# EAGLE schematic External Diagram FSAE 2024 (EAGLE 9.6.2)
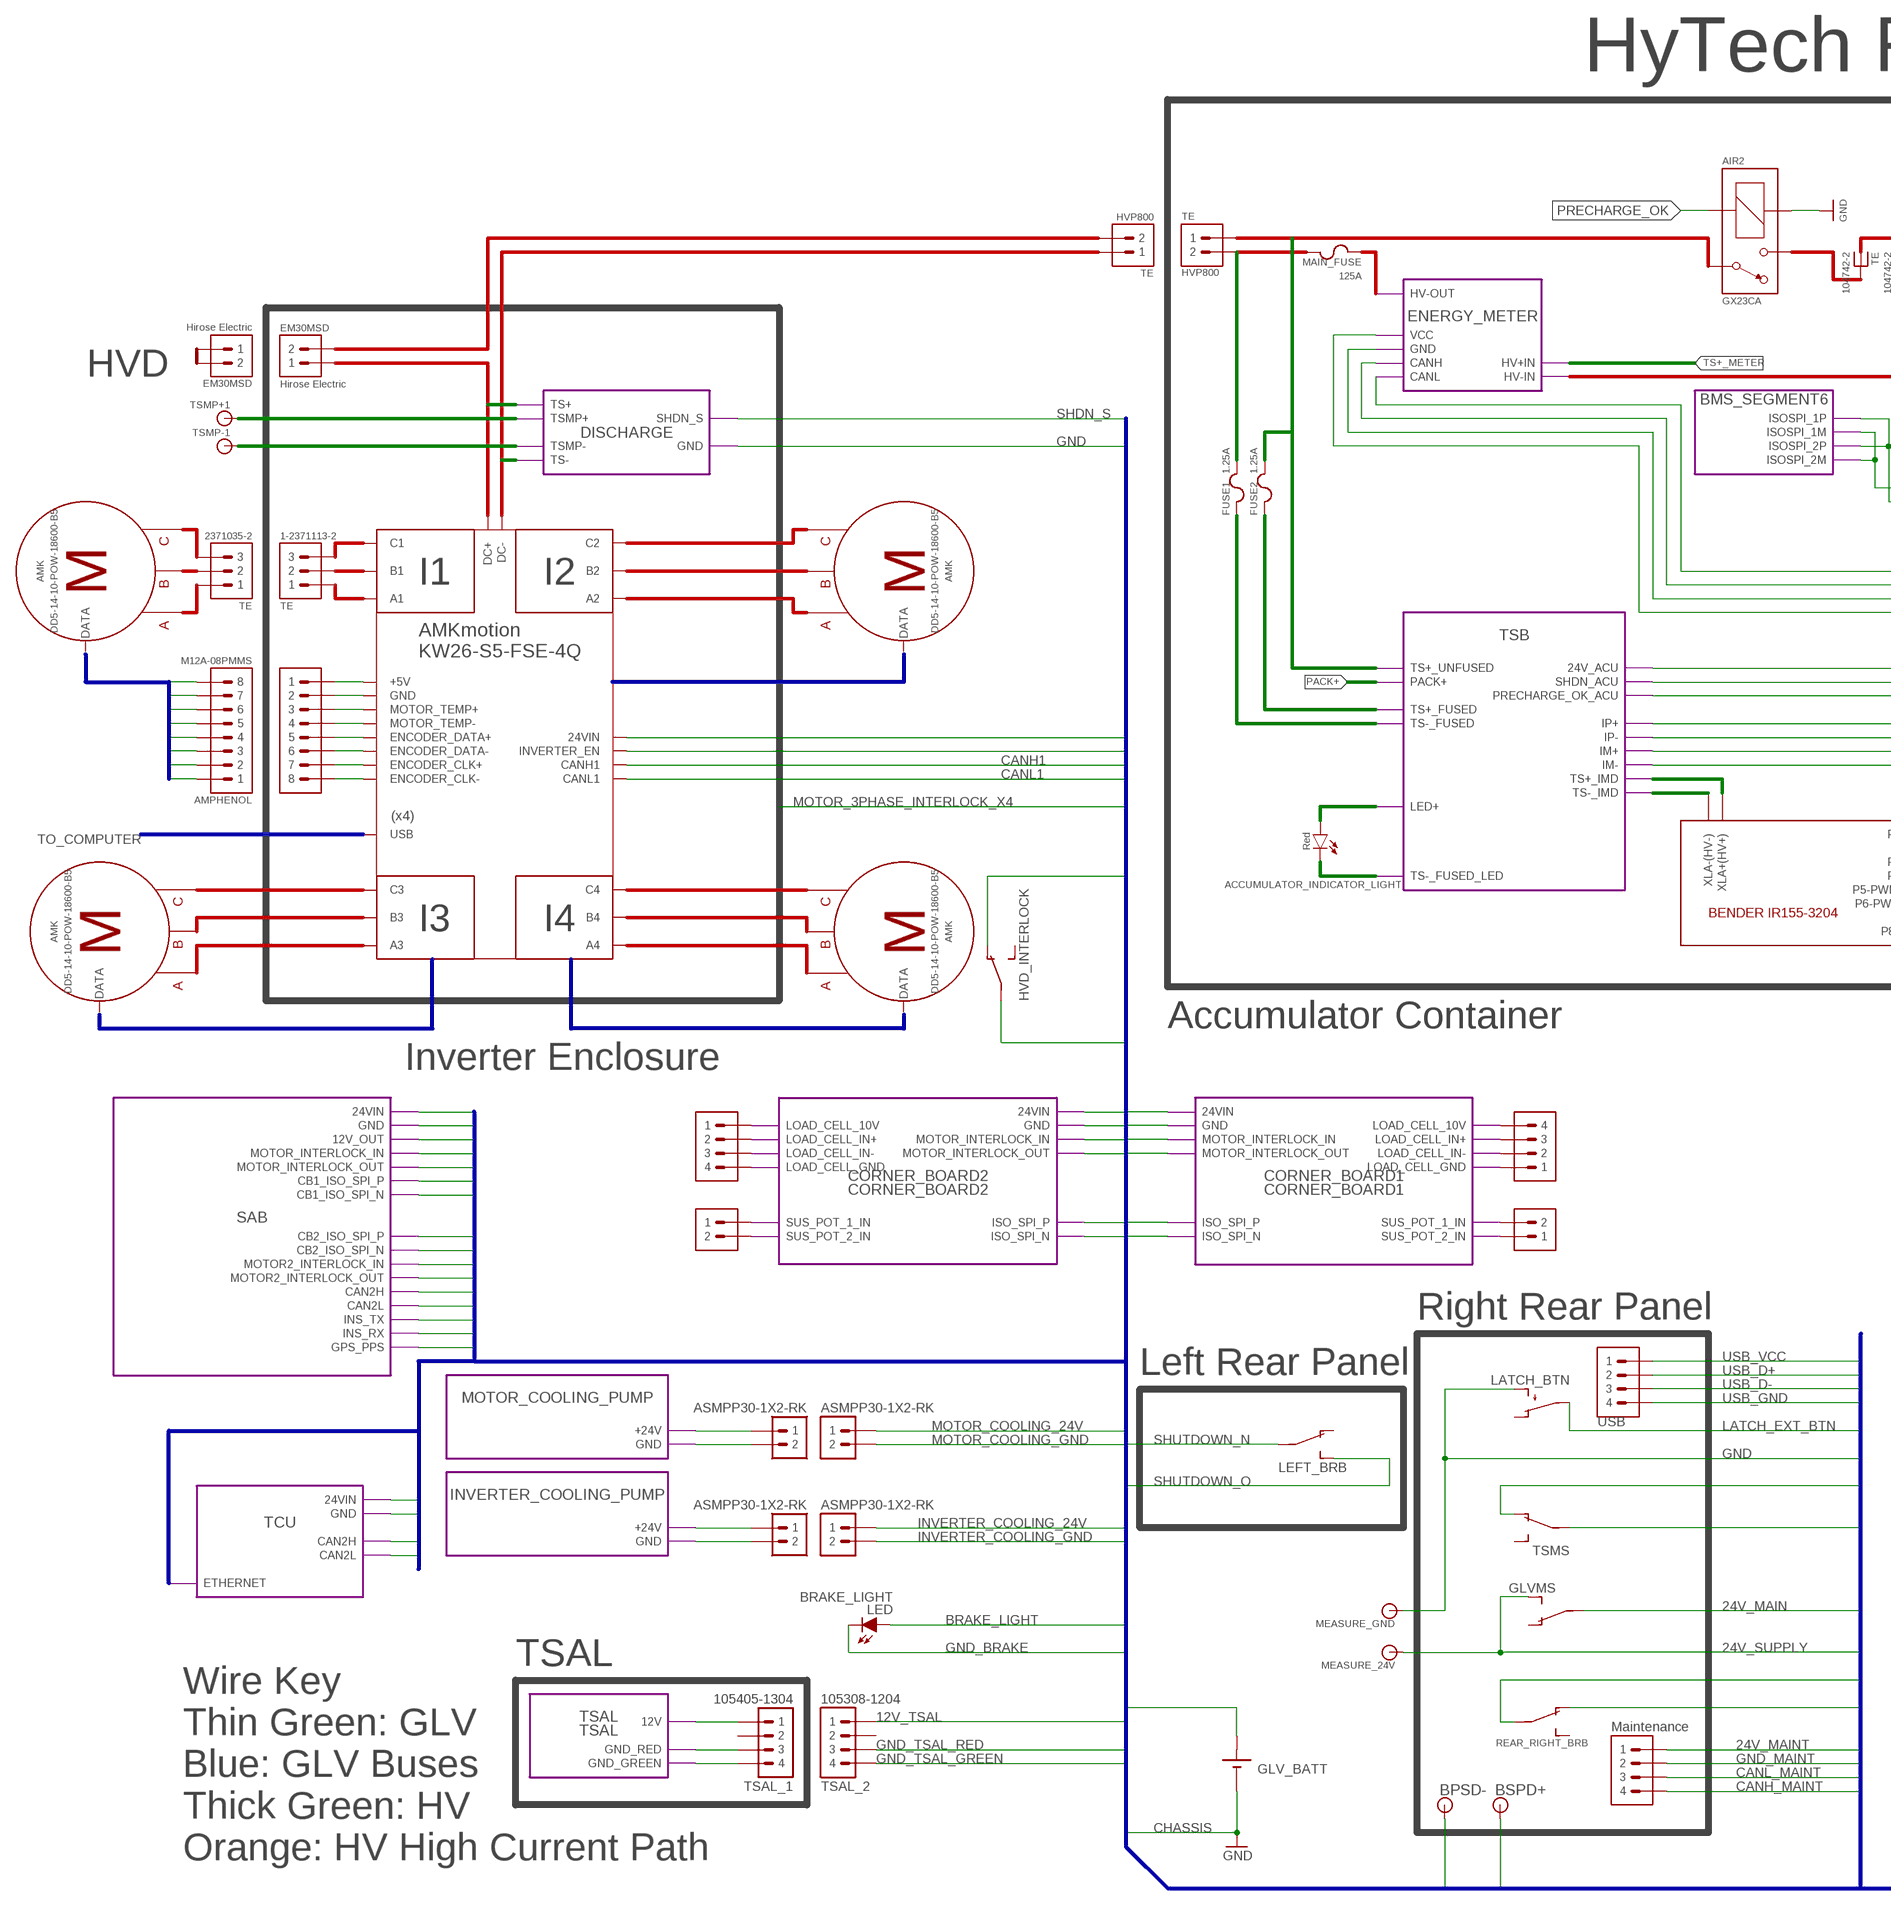
[diagram p0: schematic, sheet 1, part 1 of 2]
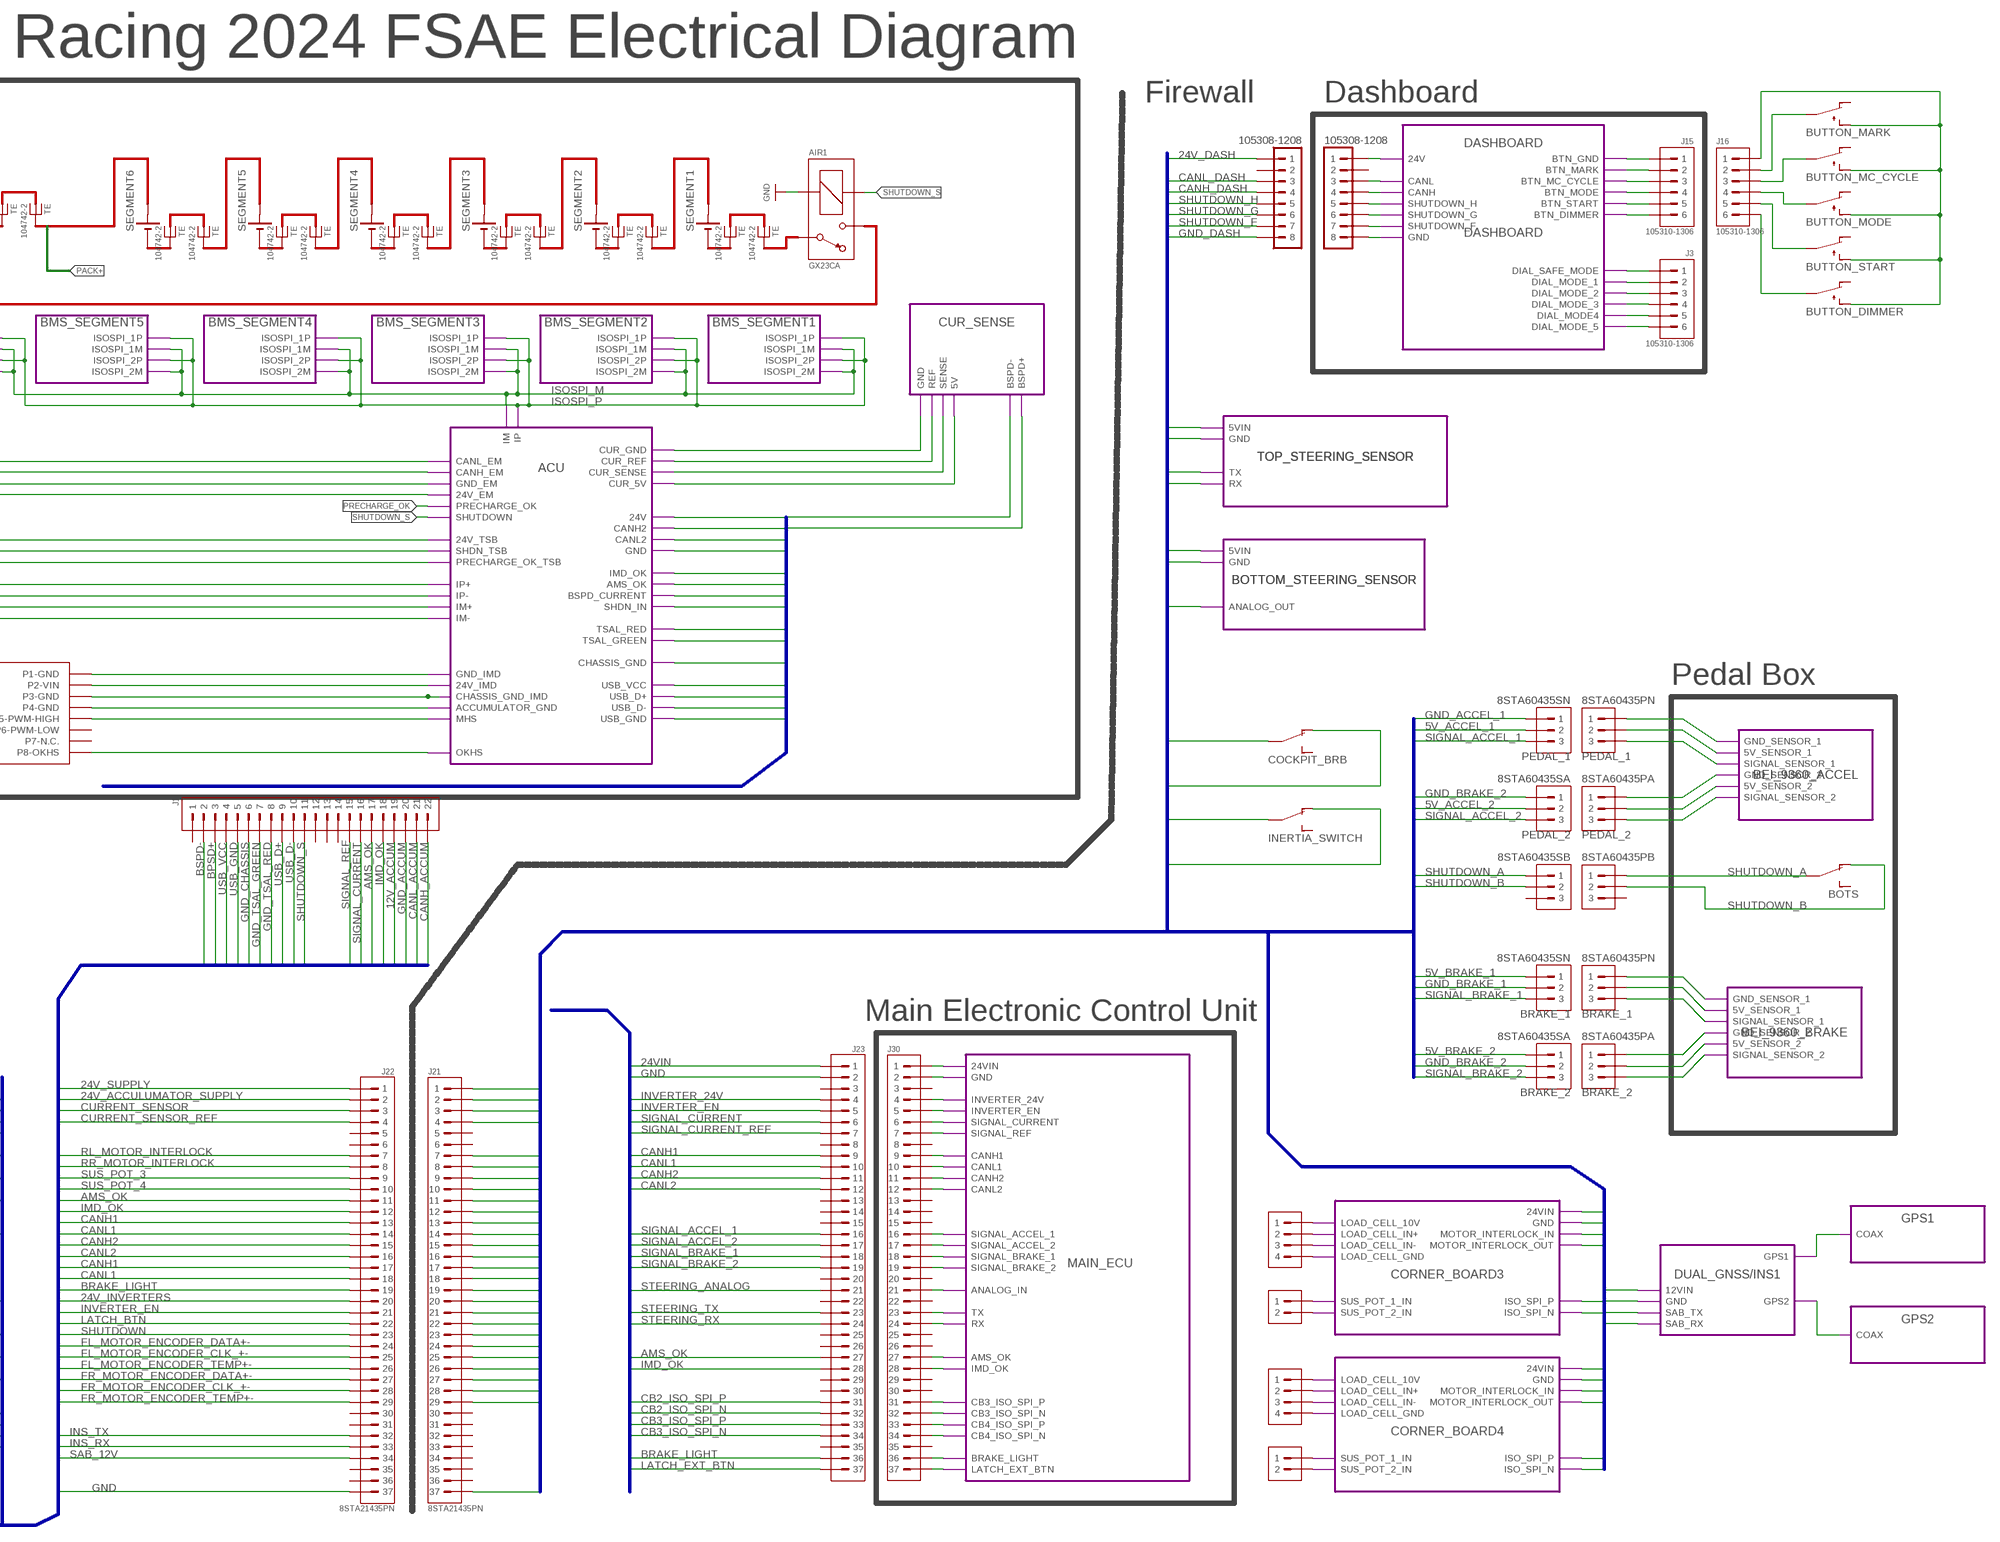
[diagram p1: schematic, sheet 1, part 2 of 2]

## Parts
ACCUMULATOR_INDICATOR_LIGHT  LED_0603_RED  [0603-LED]
AIR1  RELAY_SPST_NO_GX23BA  (no package)
AIR2  RELAY_SPST_NO_GX23BA  (no package)
BOTS  SWITCH_SPST  (no package)
BPSD-  BANANA_JACK  (no package)
BRAKE_LIGHT  LED  (no package)
BSPD+  BANANA_JACK  (no package)
BUTTON_DIMMER  SWITCH_SPST_MOM  (no package)
BUTTON_MARK  SWITCH_SPST_MOM  (no package)
BUTTON_MC_CYCLE  SWITCH_SPST_MOM  (no package)
BUTTON_MODE  SWITCH_SPST_MOM  (no package)
BUTTON_START  SWITCH_SPST_MOM  (no package)
COCKPIT_BRB  SWITCH_SPST  (no package)
DASH_IN_3  105308-1208  M08  (no package)
DASH_IN_4  105308-1208  M08  (no package)
FUSE1  1.25A  FUSE  (no package)
FUSE2  1.25A  FUSE  (no package)
GLV_BATT  BATTERY_1_CELL  (no package)
GLVMS  SWITCH_SPST  (no package)
HVD_INTERLOCK  SWITCH_SPST  (no package)
INERTIA_SWITCH  SWITCH_SPST  (no package)
J1  CONNECTOR-22_SOURIAU_  [SOURIAU_12-35]
J2  CONNECTOR-4_  (no package)
J3  CONNECTOR-6_NF_T_V_BLACK  [MOLEX_NANOFIT_PTH_06]
J4  CONNECTOR-4_  (no package)
J5  CONNECTOR-3_  (no package)
J6  CONNECTOR-3_  (no package)
J7  CONNECTOR-3_  (no package)
J8  CONNECTOR-3_  (no package)
J9  CONNECTOR-3_  (no package)
J10  CONNECTOR-3_  (no package)
J11  CONNECTOR-3_  (no package)
J12  CONNECTOR-3_  (no package)
J13  CONNECTOR-3_  (no package)
J14  CONNECTOR-3_  (no package)
J15  CONNECTOR-6_NF_T_V_BLACK  [MOLEX_NANOFIT_PTH_06]
J16  CONNECTOR-6_NF_T_V_BLACK  [MOLEX_NANOFIT_PTH_06]
J17  CONNECTOR-2_0436500214  (no package)
J18  CONNECTOR-4_  (no package)
J19  CONNECTOR-2_0436500214  (no package)
J20  CONNECTOR-4_  (no package)
J21  CONNECTOR-37__  [SOURIAU_14-35]
J22  CONNECTOR-37__  [SOURIAU_14-35]
J23  CONNECTOR-37__  [SOURIAU_14-35]
J24  CONNECTOR-8_  (no package)
J25  CONNECTOR-8_  (no package)
J28  CONNECTOR-2_HIROSE  (no package)
J29  CONNECTOR-2_HIROSE  (no package)
J30  CONNECTOR-37__  [SOURIAU_14-35]
J31  CONNECTOR-4_  (no package)
J32  CONNECTOR-2_0436500214  (no package)
J33  CONNECTOR-4_  (no package)
J34  CONNECTOR-2_0436500214  (no package)
J35  CONNECTOR-3_2371035-2  (no package)
J36  CONNECTOR-3_1-2371113-2  (no package)
LATCH_BTN  SWITCH_SPST_MOM  (no package)
MAIN_FUSE  125A  FUSE  (no package)
MEASURE_24V  BANANA_JACK  (no package)
MEASURE_GND  BANANA_JACK  (no package)
PUMP_1  ASMPP30-1X2-RK  M02  (no package)
PUMP_2  ASMPP30-1X2-RK  M02  (no package)
PUMP_3  ASMPP30-1X2-RK  M02  (no package)
PUMP_4  ASMPP30-1X2-RK  M02  (no package)
S2  SWITCH_SPST_40MM_STOP  (no package)
S3  SWITCH_SPST_40MM_STOP  (no package)
SEGMENT1  BATTERY_1_CELL  (no package)
SEGMENT2  BATTERY_1_CELL  (no package)
SEGMENT3  BATTERY_1_CELL  (no package)
SEGMENT4  BATTERY_1_CELL  (no package)
SEGMENT5  BATTERY_1_CELL  (no package)
SEGMENT6  BATTERY_1_CELL  (no package)
TSAL_1  105405-1304  M04  (no package)
TSAL_2  105308-1204  M04  (no package)
TSMP+1  BANANA_JACK  (no package)
TSMP-1  BANANA_JACK  (no package)
TSMS  SWITCH_SPST  (no package)
U$1  MAINTENANCE_PLUG_104742-2  (no package)
U$2  BENDER_IR155-3204  (no package)
U$3  MAINTENANCE_PLUG_104742-2  (no package)
U$4  MAINTENANCE_PLUG_104742-2  (no package)
U$5  MAINTENANCE_PLUG_104742-2  (no package)
U$6  MAINTENANCE_PLUG_104742-2  (no package)
U$7  MAINTENANCE_PLUG_104742-2  (no package)
U$8  MAINTENANCE_PLUG_104742-2  (no package)
U$9  MAINTENANCE_PLUG_104742-2  (no package)
U$10  MAINTENANCE_PLUG_104742-2  (no package)
U$11  MAINTENANCE_PLUG_104742-2  (no package)
U$12  AMKBIG  (no package)
U$13  MOTOR_AC_SMALL_AMK  (no package)
U$14  MOTOR_AC_SMALL_AMK  (no package)
U$15  MAINTENANCE_PLUG_104742-2  (no package)
U$16  MOTOR_AC_SMALL_AMK  (no package)
U$17  MOTOR_AC_SMALL_AMK  (no package)
U$18  MAINTENANCE_PLUG_104742-2  (no package)
U$19  MAINTENANCE_PLUG_104742-2  (no package)
U$20  MAINTENANCE_PLUG_104742-2  (no package)
U$21  CONNECTOR-2_HVP800  (no package)
U$22  CONNECTOR-2_HVP800  (no package)

## Module instances
BMS_SEGMENT2 = BMS_SEGMENT
BMS_SEGMENT3 = BMS_SEGMENT
BMS_SEGMENT4 = BMS_SEGMENT
MOTOR_COOLING_PUMP = COOLING_MODULE
MAIN_ECU = MAIN_ECU
BEI_9360_ACCEL = BEI_9360
ENERGY_METER = ENERGY_METER
ACU = ACU
DASHBOARD = DASHBOARD
BMS_SEGMENT1 = BMS_SEGMENT
TSB = TSB
TSAL = TSAL
CUR_SENSE = CUR_SENSE
DISCHARGE = DISCHARGE (part numbers offset by 200)
BMS_SEGMENT5 = BMS_SEGMENT
BMS_SEGMENT6 = BMS_SEGMENT
INVERTER_COOLING_PUMP = COOLING_MODULE
BEI_9360_BRAKE = BEI_9360
TOP_STEERING_SENSOR = TOP_STEERING_SENSOR
BOTTOM_STEERING_SENSOR = BOTTOM_STEERING_SENSOR
CORNER_BOARD1 = CORNER_BOARD
CORNER_BOARD2 = CORNER_BOARD
CORNER_BOARD4 = CORNER_BOARD
CORNER_BOARD3 = CORNER_BOARD
SAB = SAB
TCU = TCU
DUAL_GNSS/INS1 = DUAL_GNSS/INS
GPS1 = GPS
GPS2 = GPS

## Nets
5V_ACCEL_1: J11.2
5V_ACCEL_2: J12.2
5V_BRAKE_1: J7.1
5V_BRAKE_2: J8.1
12V_ACCUM: J1.19
12V_TSAL: TSAL_2.1
12VSUPPLY_COOLING_PUMP_1: PUMP_2.1 ; port MOTOR_COOLING_PUMP.+24V
12VSUPPLY_COOLING_PUMP_2: PUMP_3.1 ; port INVERTER_COOLING_PUMP.+24V
24V_ACCULUMATOR_SUPPLY: J22.2
24V_DASH: DASH_IN_4.1
24V_INVERTERS: J22.20
24V_MAIN: GLVMS.P
24V_MAINT: J20.1
24V_SUPPLY: GLVMS.S J22.1 MEASURE_24V.1
24VIN: J23.1
+5V_MOTOR: J25.8
AMS_OK: J1.17 J22.11 J23.27
B$1: port ACU.24V ACU.CANH2 ACU.GND ACU.CANL2 ACU.IMD_OK ACU.AMS_OK ACU.BSPD_CURRENT ACU.SHDN_IN ACU.TSAL_RED ACU.TSAL_GREEN ACU.CHASSIS_GND ACU.USB_VCC ACU.USB_D+ ACU.USB_D- SAB.GPS_PPS SAB.INS_RX SAB.INS_TX SAB.MOTOR2_INTERLOCK_OUT SAB.MOTOR2_INTERLOCK_IN SAB.CB2_ISO_SPI_N SAB.CB2_ISO_SPI_P SAB.CB1_ISO_SPI_N SAB.CB1_ISO_SPI_P SAB.MOTOR_INTERLOCK_OUT SAB.MOTOR_INTERLOCK_IN SAB.GND SAB.24VIN TCU.24VIN TCU.GND TCU.CAN2H TCU.CAN2L SAB.CAN2H SAB.CAN2L SAB.12V_OUT
BAT+: GLV_BATT.+
BPSD+: BSPD+.1 J1.3
BRAKE_LIGHT: BRAKE_LIGHT.A J22.19 J23.36
BSPD-: BPSD-.1 J1.2
CANH1: J22.13 J22.17 J23.9 U$12.24VIN
CANH2: J22.15 J23.11 U$12.CANH1
CANH_ACCUM: J1.22
CANH_DASH: DASH_IN_4.4
CANH_MAINT: J20.4
CANL1: J22.14 J22.18 J23.10 U$12.INVERTER_EN
CANL2: J22.16 J23.12 U$12.CANL1
CANL_ACCUM: J1.21
CANL_DASH: DASH_IN_4.3
CANL_MAINT: J20.3
CB2_ISO_SPI_N: J23.32
CB2_ISO_SPI_P: J23.31
CB3_ISO_SPI_N: J23.34
CB3_ISO_SPI_P: J23.33
CURRENT_SENSOR: J22.3
CURRENT_SENSOR_REF: J22.4
ENCODER_CLK+: J25.2
ENCODER_CLK-: J25.1
ENCODER_DATA+: J25.4
ENCODER_DATA-: J25.3
FL_MOTOR_ENCODER_CLK_+-: J22.25
FL_MOTOR_ENCODER_DATA+-: J22.24
FL_MOTOR_ENCODER_TEMP+-: J22.26
FR_MOTOR_ENCODER_CLK_+-: J22.28
FR_MOTOR_ENCODER_DATA+-: J22.27
FR_MOTOR_ENCODER_TEMP+-: J22.29
GND: AIR1.COIL+ AIR2.COIL- GLV_BATT.- J22.37 J23.2 J25.7 LATCH_BTN.S MEASURE_GND.1 ; port DISCHARGE.GND
GND_ACCEL_1: J11.1
GND_ACCUM: J1.20
GND_BRAKE: BRAKE_LIGHT.C
GND_BRAKE_1: J7.2
GND_BRAKE_2: J8.2 J12.1
GND_CHASSIS: J1.6
GND_DASH: DASH_IN_4.8
GND_MAINT: J20.2
GND_RADIATOR: PUMP_2.2 PUMP_3.2 ; port MOTOR_COOLING_PUMP.GND INVERTER_COOLING_PUMP.GND
GND_TSAL_GREEN: J1.7 TSAL_2.4
GND_TSAL_RED: J1.8 TSAL_2.3
IMD_OK: J1.18 J22.12 J23.28
INS_RX: J22.33
INS_TX: J22.32
INVERTER_24V: J23.4
INVERTER_COOLING_24V: PUMP_4.1
INVERTER_COOLING_GND: PUMP_4.2
INVERTER_EN: J22.21 J23.5
ISOSPI_M: port BMS_SEGMENT2.ISOSPI_1M BMS_SEGMENT2.ISOSPI_2M BMS_SEGMENT4.ISOSPI_2M BMS_SEGMENT4.ISOSPI_1M BMS_SEGMENT3.ISOSPI_2M BMS_SEGMENT3.ISOSPI_1M ACU.IM BMS_SEGMENT5.ISOSPI_1M BMS_SEGMENT5.ISOSPI_2M BMS_SEGMENT6.ISOSPI_1M BMS_SEGMENT6.ISOSPI_2M
ISOSPI_P: port BMS_SEGMENT2.ISOSPI_1P BMS_SEGMENT2.ISOSPI_2P BMS_SEGMENT4.ISOSPI_1P BMS_SEGMENT3.ISOSPI_1P BMS_SEGMENT3.ISOSPI_2P ACU.IP BMS_SEGMENT5.ISOSPI_1P BMS_SEGMENT5.ISOSPI_2P BMS_SEGMENT4.ISOSPI_2P BMS_SEGMENT6.ISOSPI_1P BMS_SEGMENT6.ISOSPI_2P
LATCH_BTN: J22.22
LATCH_EXT_BTN: J23.37 LATCH_BTN.P
MOTOR_COOLING_24V: PUMP_1.1
MOTOR_COOLING_GND: PUMP_1.2
MOTOR_TEMP+: J25.6
MOTOR_TEMP-: J25.5
N$1: BUTTON_START.P J16.5
N$2: ACCUMULATOR_INDICATOR_LIGHT.2(A) ; port TSB.LED+
N$3: TSAL_1.1 ; port TSAL.12V
N$5: port CUR_SENSE.BSPD+
N$6: port ACU.USB_GND
N$7: J24.1 U$12.+5V
N$8: port TSB.IM+ ACU.IM+
N$9: port TSB.IP- ACU.IP-
N$10: port TSB.IP+ ACU.IP+
N$11: port TSB.24V_ACU ACU.24V_TSB
N$12: J5.1 ; port BEI_9360_BRAKE.GND_SENSOR_1
N$13: J5.2 ; port BEI_9360_BRAKE.5V_SENSOR_1
N$14: J5.3 ; port BEI_9360_BRAKE.SIGNAL_SENSOR_1
N$15: DASH_IN_3.1 ; port DASHBOARD.24V
N$16: J6.1 ; port BEI_9360_BRAKE.GND_SENSOR_2
N$17: J24.2 U$12.GND
N$18: DASH_IN_3.3 ; port DASHBOARD.CANL
N$19: DASH_IN_3.4 ; port DASHBOARD.CANH
N$20: J10.1 ; port BEI_9360_ACCEL.GND_SENSOR_2
N$21: DASH_IN_3.5 ; port DASHBOARD.SHUTDOWN_H
N$22: DASH_IN_3.6 ; port DASHBOARD.SHUTDOWN_G
N$23: DASH_IN_3.7 ; port DASHBOARD.SHUTDOWN_F
N$24: J24.3 U$12.MOTOR_TEMP+
N$25: J10.2 ; port BEI_9360_ACCEL.5V_SENSOR_2
N$26: port TSB.IM- ACU.IM-
N$27: J15.1 ; port DASHBOARD.BTN_GND
N$28: J15.2 ; port DASHBOARD.BTN_MARK
N$29: J15.3 ; port DASHBOARD.BTN_MC_CYCLE
N$30: J15.4 ; port DASHBOARD.BTN_MODE
N$31: J15.5 ; port DASHBOARD.BTN_START
N$32: J15.6 ; port DASHBOARD.BTN_DIMMER
N$33: J24.4 U$12.MOTOR_TEMP-
N$34: J24.5 U$12.ENCODER_DATA+
N$35: port TSB.SHDN_ACU ACU.SHDN_TSB
N$36: J9.1 ; port BEI_9360_ACCEL.GND_SENSOR_1
N$37: J6.2 ; port BEI_9360_BRAKE.5V_SENSOR_2
N$38: port TSB.PRECHARGE_OK_ACU ACU.PRECHARGE_OK_TSB
N$39: J10.3 ; port BEI_9360_ACCEL.SIGNAL_SENSOR_2
N$40: port CUR_SENSE.BSPD-
N$41: BUTTON_MODE.P J16.4
N$42: U$2.P1-GND ; port ACU.GND_IMD
N$43: BUTTON_MC_CYCLE.P J16.3
N$44: U$2.P2-VIN ; port ACU.24V_IMD
N$45: U$2.P3-GND ; port ACU.CHASSIS_GND_IMD
N$46: U$2.P4-GND ; port ACU.ACCUMULATOR_GND
N$47: BUTTON_DIMMER.S BUTTON_MARK.S BUTTON_MC_CYCLE.S BUTTON_MODE.S BUTTON_START.S J16.1
N$48: BUTTON_MARK.P J16.2
N$49: BUTTON_DIMMER.P J16.6
N$50: J6.3 ; port BEI_9360_BRAKE.SIGNAL_SENSOR_2
N$51: J9.2 ; port BEI_9360_ACCEL.5V_SENSOR_1
N$52: J9.3 ; port BEI_9360_ACCEL.SIGNAL_SENSOR_1
N$53: DASH_IN_3.8 ; port DASHBOARD.GND
N$54: J3.1 ; port DASHBOARD.DIAL_SAFE_MODE
N$55: J3.2 ; port DASHBOARD.DIAL_MODE_1
N$56: J3.3 ; port DASHBOARD.DIAL_MODE_2
N$57: J3.4 ; port DASHBOARD.DIAL_MODE_3
N$58: J3.5 ; port DASHBOARD.DIAL_MODE4
N$59: J3.6 ; port DASHBOARD.DIAL_MODE_5
N$60: port ENERGY_METER.VCC ACU.24V_EM
N$61: port DISCHARGE.TS+
N$62: FUSE1.2 U$21.2
N$63: FUSE2.1 ; port TSB.TS+_FUSED DUAL_GNSS/INS1.GND
N$64: J24.6 U$12.ENCODER_DATA-
N$65: J24.7 U$12.ENCODER_CLK+ ; port DUAL_GNSS/INS1.SAB_TX
N$66: J24.8 U$12.ENCODER_CLK- ; port DUAL_GNSS/INS1.SAB_RX
N$67: U$2.P5-PWM-HIGH ; port ACU.MHS
N$68: FUSE1.1 ; port TSB.TS-_FUSED
N$69: ACCUMULATOR_INDICATOR_LIGHT.1(C) ; port TSB.TS-_FUSED_LED
N$70: port TOP_STEERING_SENSOR.5VIN
N$71: port TOP_STEERING_SENSOR.GND
N$72: U$2.XLA+(HV+) ; port TSB.TS+_IMD
N$73: port DUAL_GNSS/INS1.GPS2 GPS2.COAX
N$74: port TOP_STEERING_SENSOR.TX
N$75: port ACU.CUR_5V CUR_SENSE.5V
N$76: U$2.XLA-(HV-) ; port TSB.TS-_IMD
N$77: J30.1 ; port MAIN_ECU.24VIN
N$78: port ENERGY_METER.CANL ACU.CANL_EM DUAL_GNSS/INS1.12VIN
N$79: TSMP+1.1 ; port DISCHARGE.TSMP+
N$80: port TOP_STEERING_SENSOR.RX
N$81: TSAL_1.3 ; port TSAL.GND_RED
N$82: TSAL_1.4 ; port TSAL.GND_GREEN
N$83: port DUAL_GNSS/INS1.GPS1 GPS1.COAX
N$84: port BOTTOM_STEERING_SENSOR.5VIN
N$85: port BOTTOM_STEERING_SENSOR.GND
N$86: port BOTTOM_STEERING_SENSOR.ANALOG_OUT
N$87: J4.1 ; port CORNER_BOARD1.LOAD_CELL_GND
N$88: J4.2 ; port CORNER_BOARD1.LOAD_CELL_IN-
N$89: J4.3 ; port CORNER_BOARD1.LOAD_CELL_IN+
N$90: J4.4 ; port CORNER_BOARD1.LOAD_CELL_10V
N$91: J17.1 ; port CORNER_BOARD1.SUS_POT_2_IN
N$92: J17.2 ; port CORNER_BOARD1.SUS_POT_1_IN
N$93: J19.1 ; port CORNER_BOARD2.SUS_POT_1_IN
N$94: TSMP-1.1 ; port DISCHARGE.TSMP-
N$95: J19.2 ; port CORNER_BOARD2.SUS_POT_2_IN
N$96: J18.1 ; port CORNER_BOARD2.LOAD_CELL_10V
N$97: J18.2 ; port CORNER_BOARD2.LOAD_CELL_IN+
N$98: J18.3 ; port CORNER_BOARD2.LOAD_CELL_IN-
N$99: J18.4 ; port CORNER_BOARD2.LOAD_CELL_GND
N$100: port CORNER_BOARD2.24VIN
N$101: port CORNER_BOARD2.GND
N$102: U$2.P8-OKHS ; port ACU.OKHS
N$103: port CORNER_BOARD2.MOTOR_INTERLOCK_IN
N$104: port ENERGY_METER.GND ACU.GND_EM
N$105: port ENERGY_METER.CANH ACU.CANH_EM
N$106: port ACU.CUR_SENSE CUR_SENSE.SENSE
N$107: port ACU.CUR_REF CUR_SENSE.REF
N$108: port ACU.CUR_GND CUR_SENSE.GND
N$109: port CORNER_BOARD2.MOTOR_INTERLOCK_OUT
N$111: port CORNER_BOARD2.ISO_SPI_P
N$112: port CORNER_BOARD2.ISO_SPI_N
N$113: port CORNER_BOARD1.24VIN
N$114: port CORNER_BOARD1.GND
N$115: port CORNER_BOARD1.MOTOR_INTERLOCK_IN
N$116: port CORNER_BOARD1.MOTOR_INTERLOCK_OUT
N$118: port CORNER_BOARD1.ISO_SPI_P
N$119: port CORNER_BOARD1.ISO_SPI_N
N$120: J21.1
N$121: J21.2
N$122: J21.3
N$123: J21.4
N$126: J21.7
N$127: J21.8
N$128: J21.9
N$129: J21.10
N$130: J21.11
N$131: J21.37
N$132: J21.29
N$133: J21.28
N$134: J21.27
N$135: J21.26
N$136: J21.25
N$137: J21.24
N$138: J21.23
N$139: J21.22
N$140: J21.21
N$141: J21.20
N$142: J21.19
N$143: J21.18
N$144: J21.17
N$145: J21.16
N$146: J21.15
N$147: J21.14
N$148: J21.13
N$149: J21.12
N$150: J30.2 ; port MAIN_ECU.GND
N$151: J30.4 ; port MAIN_ECU.INVERTER_24V
N$152: J30.5 ; port MAIN_ECU.INVERTER_EN
N$153: J30.7 ; port MAIN_ECU.SIGNAL_REF
N$154: J30.6 ; port MAIN_ECU.SIGNAL_CURRENT
N$155: J30.9 ; port MAIN_ECU.CANH1
N$156: J30.10 ; port MAIN_ECU.CANL1
N$157: J30.11 ; port MAIN_ECU.CANH2
N$158: J30.12 ; port MAIN_ECU.CANL2
N$161: J30.16 ; port MAIN_ECU.SIGNAL_ACCEL_1
N$162: J30.17 ; port MAIN_ECU.SIGNAL_ACCEL_2
N$163: J30.18 ; port MAIN_ECU.SIGNAL_BRAKE_1
N$164: J30.19 ; port MAIN_ECU.SIGNAL_BRAKE_2
N$165: J30.21 ; port MAIN_ECU.ANALOG_IN
N$167: J30.23 ; port MAIN_ECU.TX
N$168: J30.24 ; port MAIN_ECU.RX
N$170: J30.27 ; port MAIN_ECU.AMS_OK
N$171: J30.28 ; port MAIN_ECU.IMD_OK
N$172: J30.31 ; port MAIN_ECU.CB3_ISO_SPI_P
N$173: J30.32 ; port MAIN_ECU.CB3_ISO_SPI_N
N$174: J30.33 ; port MAIN_ECU.CB4_ISO_SPI_P
N$175: J30.34 ; port MAIN_ECU.CB4_ISO_SPI_N
N$176: J30.36 ; port MAIN_ECU.BRAKE_LIGHT
N$177: J30.37 ; port MAIN_ECU.LATCH_EXT_BTN
N$178: J32.1 ; port CORNER_BOARD3.SUS_POT_1_IN
N$179: J32.2 ; port CORNER_BOARD3.SUS_POT_2_IN
N$180: J31.1 ; port CORNER_BOARD3.LOAD_CELL_10V
N$181: J31.2 ; port CORNER_BOARD3.LOAD_CELL_IN+
N$182: J31.3 ; port CORNER_BOARD3.LOAD_CELL_IN-
N$183: J31.4 ; port CORNER_BOARD3.LOAD_CELL_GND
N$184: J34.1 ; port CORNER_BOARD4.SUS_POT_1_IN
N$185: J34.2 ; port CORNER_BOARD4.SUS_POT_2_IN
N$186: J33.1 ; port CORNER_BOARD4.LOAD_CELL_10V
N$187: J33.2 ; port CORNER_BOARD4.LOAD_CELL_IN+
N$188: J33.3 ; port CORNER_BOARD4.LOAD_CELL_IN-
N$189: J33.4 ; port CORNER_BOARD4.LOAD_CELL_GND
N$190: port CORNER_BOARD4.24VIN
N$191: port CORNER_BOARD4.GND
N$192: port CORNER_BOARD4.MOTOR_INTERLOCK_IN
N$193: port CORNER_BOARD4.MOTOR_INTERLOCK_OUT
N$195: port CORNER_BOARD4.ISO_SPI_P
N$196: port CORNER_BOARD4.ISO_SPI_N
N$197: port CORNER_BOARD3.24VIN
N$198: port CORNER_BOARD3.GND
N$199: port CORNER_BOARD3.MOTOR_INTERLOCK_IN
N$200: port CORNER_BOARD3.MOTOR_INTERLOCK_OUT
N$202: port CORNER_BOARD3.ISO_SPI_P
N$203: port CORNER_BOARD3.ISO_SPI_N
N$204: port DISCHARGE.TS-
PACK+: port TSB.PACK+
PRECHARGE_OK: AIR2.COIL+ ; port ACU.PRECHARGE_OK
RL_MOTOR_INTERLOCK: J22.7
RR_MOTOR_INTERLOCK: J22.8
SAB_12V: J22.34
SHDN_S: port DISCHARGE.SHDN_S
SHUTDOWN: J22.23
SHUTDOWN_A: BOTS.P J13.1 J14.1
SHUTDOWN_B: BOTS.O J13.2 J14.2
SHUTDOWN_F: DASH_IN_4.7
SHUTDOWN_G: DASH_IN_4.6
SHUTDOWN_H: DASH_IN_4.5
SHUTDOWN_K: INERTIA_SWITCH.P
SHUTDOWN_L: COCKPIT_BRB.P INERTIA_SWITCH.O
SHUTDOWN_M: COCKPIT_BRB.O
SHUTDOWN_N: S2.P
SHUTDOWN_O: S2.S S3.P
SHUTDOWN_P: S3.O
SHUTDOWN_Q: HVD_INTERLOCK.P
SHUTDOWN_R: HVD_INTERLOCK.O TSMS.P
SHUTDOWN_S: AIR1.COIL- J1.11 TSMS.O ; port ACU.SHUTDOWN
SIGNAL_ACCEL_1: J11.3 J23.16
SIGNAL_ACCEL_2: J12.3 J23.17
SIGNAL_BRAKE_1: J7.3 J23.18
SIGNAL_BRAKE_2: J8.3 J23.19
SIGNAL_CURRENT: J1.16 J23.6
SIGNAL_CURRENT_REF: J23.7
SIGNAL_REF: J1.15
STEERING_ANALOG: J23.21
STEERING_RX: J23.24
STEERING_TX: J23.23
SUS_POT_3: J22.9
SUS_POT_4: J22.10
TS+_METER: port ENERGY_METER.HV+IN
TS+_UNFUSED: FUSE2.2 ; port TSB.TS+_UNFUSED
USB_D+: J1.9 J2.2
USB_D-: J1.10 J2.3
USB_GND: J1.5 J2.4
USB_VCC: J1.4 J2.1
Unconnected: AIR1.CONTACT1 AIR1.CONTACT2 AIR2.CONTACT1 AIR2.CONTACT2 BOTS.S BUTTON_DIMMER.O BUTTON_MARK.O BUTTON_MC_CYCLE.O BUTTON_MODE.O BUTTON_START.O COCKPIT_BRB.S DASH_IN_3.2 DASH_IN_4.2 GLVMS.O HVD_INTERLOCK.S INERTIA_SWITCH.S J1.1 J1.12 J1.13 J1.14 J13.3 J14.3 J21.5 J21.6 J21.30 J21.31 J21.32 J21.33 J21.34 J21.35 J21.36 J22.5 J22.6 J22.30 J22.31 J22.35 J22.36 J23.3 J23.8 J23.13 J23.14 J23.15 J23.20 J23.22 J23.25 J23.26 J23.29 J23.30 J23.35 J28.1 J28.2 J29.1 J29.2 J30.3 J30.8 J30.13 J30.14 J30.15 J30.20 J30.22 J30.25 J30.26 J30.29 J30.30 J30.35 J35.1 J35.2 J35.3 J36.1 J36.2 J36.3 LATCH_BTN.O MAIN_FUSE.1 MAIN_FUSE.2 S2.O S3.S SEGMENT1.+ SEGMENT1.- SEGMENT2.+ SEGMENT2.- SEGMENT3.+ SEGMENT3.- SEGMENT4.+ SEGMENT4.- SEGMENT5.+ SEGMENT5.- SEGMENT6.+ SEGMENT6.- TSAL_1.2 TSAL_2.2 TSMS.S U$1.1 U$1.P$1 U$2.P6-PWM-LOW U$2.P7-N.C. U$3.1 U$3.P$1 U$4.1 U$4.P$1 U$5.1 U$5.P$1 U$6.1 U$6.P$1 U$7.1 U$7.P$1 U$8.1 U$8.P$1 U$9.1 U$9.P$1 U$10.1 U$10.P$1 U$11.1 U$11.P$1 U$12.A1 U$12.A2 U$12.A3 U$12.A4 U$12.B1 U$12.B2 U$12.B3 U$12.B4 U$12.C1 U$12.C2 U$12.C3 U$12.C4 U$12.DC+ U$12.DC- U$12.USB U$13.A U$13.B U$13.C U$13.DATA U$14.A U$14.B U$14.C U$14.DATA U$15.1 U$15.P$1 U$16.A U$16.B U$16.C U$16.DATA U$17.A U$17.B U$17.C U$17.DATA U$18.1 U$18.P$1 U$19.1 U$19.P$1 U$20.1 U$20.P$1 U$21.1 U$22.1 U$22.2

## Buses
5V_ACCEL_1,5V_ACCEL_2,5V_BRAKE,5V_BRAKE_1,5V_BRAKE_2,+5V_MOTOR,12V_ACCUM,12V_ACCUM_MAINT,12V_AFTER_LEFT_BRB,12V_DCDC_1,12V_DCDC_2,12V_MC,12VSUPPLY_COOLING_FAN_1,12VSUPPLY_COOLING_FAN_2,12VSUPPLY_COOLING_FAN_3,12VSUPPLY_COOLING_PUMP_1,12VSUPPLY_COOLING_PUMP_2,12VSUPPLY_COOLING_UNSWITCHED,12VSUPPLY_UNSWITCHED,12V_TSAL,12V_WHEEL_SPEED_FRONT_LEFT,12V_WHEEL_SPEED_FRONT_RIGHT,12V_WHEEL_SPEED_REAR_LEFT,12V_WHEEL_SPEED_REAR_RIGHT,24V_ACCULUMATOR_SUPPLY,24V_DASH,24VIN,24V_INVERTERS,24V_MAIN,24V_MAINT,24V_SUPPLY,60V_THRESHOLD,60V_THRESHOLD_1,60V_THRESHOLD_2,AMS_OK,B$1,BAT+,BPSD+,BRAKE_LIGHT,BSPD-,CAN_ACCUM_SHIELD,CANH1,CANH2,CANH_ACCUM,CANH_DASH,CANH_FRONT,CANH_MAINT,CANH_MC,CANL1,CANL2,CANL_ACCUM,CANL_DASH,CANL_MAINT,CANL_MC,CB2_ISO_SPI_N,CB2_ISO_SPI_P,CB3_ISO_SPI_N,CB3_ISO_SPI_P,CHARGE_ENABLE,CURRENT_SENSOR,CURRENT_SENSOR_REF,CUR_SENSE_5V,CUR_SENSE_CUR_SENSE,CUR_SENSE_GND,CUR_SENSE_REF,DASH_1,DASH_4,DASH_5,DASH_6,DASH_8,DASH_9,DASH_11,DASH_12,ENCODER_CLK+,ENCODER_CLK-,ENCODER_DATA+,ENCODER_DATA-,FAN_1,FAN_2,FL_MOTOR_ENCODER_CLK_+-,FL_MOTOR_ENCODER_DATA+-,FL_MOTOR_ENCODER_TEMP+-,FR_MOTOR_ENCODER_CLK_+-,FR_MOTOR_ENCODER_DATA+-,FR_MOTOR_ENCODER_TEMP+-,GND,GND_ACCEL_1,GND_ACCEL_2,GND_ACCUM,GND_AUX,GND_BR,GND_BRAKE,GND_BRAKE_1,GND_BRAKE_2,GND_BR_TS,GND_CHASSIS,GND_CURRENT,GND_DASH,GND_DCDC_1,GND_DCDC1,GND_DCDC2,GND_DCDC_2,GND_DCDC_4,GND_LEFT_PANEL,GND_MAIN_ECU,GND_MAINT,GND_MC,GND_POWER_SWITCHING,GND_RADIATOR,GND_SHIELD,GND_TSAL_GREEN,GND_TSAL_RED,HV+,HV-,HV-FUSED,HV+FUSED,IMD_GND,IMD_HV-,IMD_HV+,IMD_OK,IMD_SUPPLY,INVERTER_24V,INVERTER_24VIN,INVERTER_COOLING_24V,INVERTER_COOLING_GND,INVERTER_EN,ISOSPI_M,ISOSPI_P,LATCH_BTN,LATCH_EXT_BTN,MC_MAINT_FAULT_INDIC,MC_MAINT_GND,MC_MAINT_PROG_ENA,MC_MAINT_RXD,MC_MAINT_TXD,MC_MAINT_XDCR_PWR,MOTOR_3PHASE_INTERLOCK_X4,MOTOR_COOLING_24V,MOTOR_COOLING_GND,MOTOR_COS+,MOTOR_COS-,MOTOR_EXC-,MOTOR_EXC+,MOTOR_SHIELD,MOTOR_SIN-,MOTOR_SIN+,MOTOR_TEMP-,MOTOR_TEMP+,N$1,N$2,N$3,N$4,N$5,N$6,N$7,N$8,N$9,N$10,N$11,N$12,N$13,N$14,N$15,N$16,N$17,N$18,N$19,N$20,N$21,N$22,N$23,N$24,N$25,N$26,N$27,N$28,N$29,N$30,N$31,N$32,N$33,N$34,N$35,N$36,N$37,N$38,N$39,N$40,N$41,N$42,N$43,N$44,N$45,N$46,N$47,N$48,N$49,N$50,N$51,N$52,N$53,N$54,N$55,N$56,N$57,N$58,N$59,N$60,N$62,N$63,N$64,N$65,N$66,N$67,N$68,N$69,N$70,N$71,N$72,N$73,N$74,N$75,N$76,N$77,N$78,N$79,N$80,N$81,N$82,N$83,N$84,N$85,N$86,N$87,N$88,N$89,N$90,N$91,N$92,N$93,N$94,N$95,N$96,N$97,N$98,N$99,N$100,N$101,N$102,N$103,N$104,N$105,N$106,N$107,N$108,N$109,N$110,N$111,N$112,N$113,N$114,N$115,N$116,N$117,N$118,N$119,N$120,N$121,N$122,N$123,N$124,N$125,N$126,N$127,N$128,N$129,N$130,N$131,N$132,N$133,N$134,N$135,N$136,N$137,N$138,N$139,N$140,N$141,N$142,N$143,N$144,N$145,N$146,N$147,N$148,N$149,N$150,N$151,N$152,N$153,N$154,N$155,N$156,N$157,N$158,N$159,N$160,N$161,N$162,N$163,N$164,N$165,N$166,N$167,N$168,N$169,N$170,N$171,N$172,N$173,N$174,N$175,N$176,N$177,N$178,N$179,N$180,N$181,N$182,N$183,N$184,N$185,N$186,N$187,N$188,N$189,N$190,N$191,N$192,N$193,N$194,N$195,N$196,N$197,N$198,N$199,N$200,N$201,N$202,N$203,PACK+,PRECHARGE_OK,RET_FAN_1,RL_MOTOR_INTERLOCK,RR_MOTOR_INTERLOCK,SHDN_S,SHUTDOWN,SHUTDOWN_G,SHUTDOWN_J,SHUTDOWN_K,SHUTDOWN_K_OUT,SHUTDOWN_L,SHUTDOWN_M,SHUTDOWN_N,SHUTDOWN_Q,SHUTDOWN_R,SHUTDOWN_S,SIGNAL_ACCEL_1,SIGNAL_ACCEL_2,SIGNAL_BRAKE,SIGNAL_BRAKE_1,SIGNAL_BRAKE_2,SIGNAL_CURRENT,SIGNAL_CURRENT_REF,SIGNAL_REF,SSOK,START,STEERING_ANALOG,STEERING_CS,STEERING_MOSI,STEERING_RX,STEERING_TX,SUS_POT_3,SUS_POT_4,TS+_METER,TS+_UNFUSED,USB_D-,USB_D+,USB_GND,USB_VCC,WHEEL_SPEED_2,WHEEL_SPEED_3,WHEEL_SPEED_4,WHEEL_SPEED_FRONT_LEFT,WHEEL_SPEED_FRONT_RIGHT,WHEEL_SPEED_REAR_LEFT,WHEEL_SPEED_REAR_RIGHT
HT:5V_ACCEL_1,5V_ACCEL_2,5V_BRAKE,5V_BRAKE_1,5V_BRAKE_2,+5V_MOTOR,12V_ACCUM,12V_ACCUM_MAINT,12VSUPPLY_COOLING_FAN_1,12VSUPPLY_COOLING_FAN_2,12VSUPPLY_COOLING_PUMP_1,12VSUPPLY_COOLING_PUMP_2,12VSUPPLY_COOLING_UNSWITCHED,12VSUPPLY_UNSWITCHED,12V_TSAL,24V_ACCULUMATOR_SUPPLY,24V_DASH,24VIN,24V_INVERTERS,24V_MAIN,24V_MAINT,24V_SUPPLY,AMS_OK,B$1,BAT+,BPSD+,BRAKE_LIGHT,BSPD-,CANH1,CANH2,CANH_ACCUM,CANH_DASH,CANH_FRONT,CANH_MAINT,CANH_MC,CANL1,CANL2,CANL_ACCUM,CANL_DASH,CANL_FRONT,CANL_MAINT,CANL_MC,CB2_ISO_SPI_N,CB2_ISO_SPI_P,CB3_ISO_SPI_N,CB3_ISO_SPI_P,CHARGE_ENABLE,CURRENT_SENSOR,CURRENT_SENSOR_REF,DASH_1,DASH_4,DASH_5,DASH_6,DASH_8,DASH_9,DASH_12,ENCODER_CLK+,ENCODER_CLK-,ENCODER_DATA-,ENCODER_DATA+,FAN_2,FL_MOTOR_ENCODER_CLK_+-,FL_MOTOR_ENCODER_DATA+-,FL_MOTOR_ENCODER_TEMP+-,FR_MOTOR_ENCODER_CLK_+-,FR_MOTOR_ENCODER_DATA+-,FR_MOTOR_ENCODER_TEMP+-,GND,GND_ACCEL_1,GND_ACCEL_2,GND_ACCUM,GND_ACCUM_RELAYS,GND_BRAKE,GND_BRAKE_1,GND_BRAKE_2,GND_BR_TS,GND_CHASSIS,GND_CURRENT,GND_DASH,GND_LEFT_PANEL,GND_MAIN_ECU,GND_MAINT,GND_MC,GND_RADIATOR,GND_SHIELD,GND_TSAL_GREEN,GND_TSAL_RED,IMD_OK,INVERTER_24V,INVERTER_24VIN,INVERTER_COOLING_24V,INVERTER_COOLING_GND,INVERTER_EN,ISOSPI_M,ISOSPI_P,LATCH_BTN,LATCH_EXT_BTN,MC_MAINT_GND,MC_MAINT_PROG_ENA,MC_MAINT_RXD,MC_MAINT_TXD,MC_MAINT_XDCR_PWR,MOTOR_3PHASE_INTERLOCK_X4,MOTOR_COOLING_24V,MOTOR_COOLING_GND,MOTOR_COS-,MOTOR_COS+,MOTOR_EXC+,MOTOR_EXC-,MOTOR_SHIELD,MOTOR_SIN-,MOTOR_SIN+,MOTOR_TEMP+,MOTOR_TEMP-,N$1,N$2,N$3,N$4,N$5,N$6,N$7,N$8,N$9,N$10,N$11,N$12,N$13,N$14,N$15,N$16,N$17,N$18,N$19,N$20,N$21,N$22,N$23,N$24,N$25,N$26,N$27,N$28,N$29,N$30,N$31,N$32,N$33,N$34,N$35,N$36,N$37,N$38,N$39,N$40,N$41,N$42,N$43,N$44,N$45,N$46,N$47,N$48,N$49,N$50,N$51,N$52,N$53,N$54,N$55,N$56,N$57,N$58,N$59,N$60,N$62,N$63,N$64,N$65,N$66,N$67,N$68,N$69,N$70,N$71,N$72,N$73,N$74,N$75,N$76,N$77,N$78,N$79,N$80,N$81,N$82,N$83,N$84,N$85,N$86,N$87,N$88,N$89,N$90,N$91,N$92,N$93,N$94,N$95,N$96,N$97,N$98,N$99,N$100,N$101,N$102,N$103,N$104,N$105,N$106,N$107,N$108,N$109,N$110,N$111,N$112,N$113,N$114,N$115,N$116,N$117,N$118,N$119,N$120,N$121,N$122,N$123,N$124,N$125,N$126,N$127,N$128,N$129,N$130,N$131,N$132,N$133,N$134,N$135,N$136,N$137,N$138,N$139,N$140,N$141,N$142,N$143,N$144,N$145,N$146,N$147,N$148,N$149,N$150,N$151,N$152,N$153,N$154,N$155,N$156,N$157,N$158,N$159,N$160,N$161,N$162,N$163,N$164,N$165,N$166,N$167,N$168,N$169,N$170,N$171,N$172,N$173,N$174,N$175,N$176,N$177,N$178,N$179,N$180,N$181,N$182,N$183,N$184,N$185,N$186,N$187,N$188,N$189,N$190,N$191,N$192,N$193,N$194,N$195,N$196,N$197,N$198,N$199,N$200,N$201,N$202,N$203,PACK+,PRECHARGE_OK,RET_FAN_1,RL_MOTOR_INTERLOCK,RR_MOTOR_INTERLOCK,SHDN_S,SHUTDOWN,SHUTDOWN_G,SHUTDOWN_J,SHUTDOWN_K,SHUTDOWN_L,SHUTDOWN_M,SHUTDOWN_N,SHUTDOWN_S,SIGNAL_ACCEL_1,SIGNAL_ACCEL_2,SIGNAL_BRAKE,SIGNAL_BRAKE_1,SIGNAL_BRAKE_2,SIGNAL_CURRENT,SIGNAL_CURRENT_REF,SIGNAL_REF,SSOK,STEERING_ANALOG,STEERING_CS,STEERING_MOSI,STEERING_RX,STEERING_TX,SUS_POT_3,SUS_POT_4,TSAL,TS+_METER,TS+_UNFUSED,USB_D-,USB_D+,USB_GND,USB_VCC,WHEEL_SPEED_2,WHEEL_SPEED_3,WHEEL_SPEED_4
5V_ACCEL_1,5V_ACCEL_2,5V_BRAKE,5V_BRAKE_1,5V_BRAKE_2,+5V_MOTOR,12V_ACCUM,12V_DCDC_1,12V_DCDC_2,12VSUPPLY_COOLING_PUMP_1,12V_TSAL,12V_WHEEL_SPEED_FRONT_LEFT,12V_WHEEL_SPEED_FRONT_RIGHT,12V_WHEEL_SPEED_REAR_LEFT,12V_WHEEL_SPEED_REAR_RIGHT,24V_DASH,24V_MAIN,24V_MAINT,24V_SUPPLY,AMS_OK,BAT+,BPSD+,BRAKE_LIGHT,BSPD-,CAN_ACCUM_SHIELD,CANH_ACCUM,CANH_DASH,CANH_MAINT,CANH_MC,CANL_ACCUM,CANL_DASH,CANL_MAINT,CANL_MC,DASH_1,DASH_4,DASH_5,DASH_6,DASH_8,DASH_9,DASH_11,DASH_12,ENCODER_CLK-,ENCODER_CLK+,ENCODER_DATA-,ENCODER_DATA+,FAN_1,FAN_2,GND,GND_ACCEL_1,GND_ACCEL_2,GND_ACCUM,GND_AUX,GND_BRAKE,GND_BRAKE_1,GND_BRAKE_2,GND_BR_TS,GND_CHASSIS,GND_CURRENT,GND_DASH,GND_DCDC1,GND_DCDC_1,GND_DCDC_2,GND_DCDC2,GND_LEFT_PANEL,GND_MAIN_ECU,GND_MAINT,GND_MC,GND_POWER_SWITCHING,GND_RADIATOR,GND_TSAL_GREEN,GND_TSAL_RED,IMD_OK,INVERTER_24V,ISOSPI_M,ISOSPI_P,LATCH_EXT_BTN,MC_MAINT_FAULT_INDIC,MC_MAINT_GND,MC_MAINT_PROG_ENA,MC_MAINT_RXD,MC_MAINT_TXD,MC_MAINT_XDCR_PWR,MOTOR_TEMP-,MOTOR_TEMP+,N$1,N$2,N$3,N$4,N$5,N$7,N$8,N$9,N$10,N$11,N$12,N$13,N$14,N$15,N$16,N$17,N$18,N$19,N$21,N$22,N$23,N$24,N$25,N$26,N$27,N$28,N$29,N$30,N$31,N$32,N$33,N$34,N$35,N$36,N$37,N$38,N$39,N$40,N$41,N$42,N$43,N$44,N$45,N$46,N$47,N$48,N$49,N$50,N$51,N$52,N$53,N$54,N$55,N$56,N$57,N$58,N$59,N$60,N$62,N$63,N$64,N$65,N$66,N$68,N$72,N$74,N$75,N$76,N$77,N$78,N$79,N$81,N$82,N$83,N$84,N$86,N$87,N$88,N$89,N$90,N$91,N$92,N$94,N$97,N$98,N$99,N$100,N$101,N$102,N$104,N$105,N$106,N$107,N$108,PACK+,PRECHARGE_OK,RET_FAN_1,SHUTDOWN_G,SHUTDOWN_J,SHUTDOWN_K,SHUTDOWN_L,SHUTDOWN_M,SHUTDOWN_N,SHUTDOWN_S,SIGNAL_ACCEL_1,SIGNAL_ACCEL_2,SIGNAL_BRAKE,SIGNAL_BRAKE_1,SIGNAL_BRAKE_2,SIGNAL_CURRENT,START,TS+_METER,TS+_UNFUSED,USB_D-,USB_D+,USB_GND,USB_VCC,WHEEL_SPEED_2,WHEEL_SPEED_3,WHEEL_SPEED_4,WHEEL_SPEED_FRONT_LEFT,WHEEL_SPEED_FRONT_RIGHT,WHEEL_SPEED_REAR_LEFT,WHEEL_SPEED_REAR_RIGHT
B$4
B$5
B$6
B$7
5V_ACCEL_1,5V_ACCEL_2,5V_BRAKE,5V_BRAKE_1,5V_BRAKE_2,+5V_MOTOR,12V_ACCUM,12V_DCDC_1,12V_DCDC_2,12VSUPPLY_COOLING_PUMP_1,12V_TSAL,12V_WHEEL_SPEED_FRONT_LEFT,12V_WHEEL_SPEED_FRONT_RIGHT,12V_WHEEL_SPEED_REAR_LEFT,12V_WHEEL_SPEED_REAR_RIGHT,24V_DASH,24V_MAIN,24V_MAINT,24V_SUPPLY,AMS_OK,B$1,BAT+,BPSD+,BRAKE_LIGHT,BSPD-,CAN_ACCUM_SHIELD,CANH2,CANH_ACCUM,CANH_MAINT,CANH_MC,CANL2,CANL_ACCUM,CANL_MAINT,CANL_MC,DASH_1,DASH_4,DASH_5,DASH_6,DASH_8,DASH_9,DASH_11,DASH_12,ENCODER_CLK-,ENCODER_CLK+,ENCODER_DATA+,ENCODER_DATA-,FAN_1,FAN_2,GND,GND_ACCEL_1,GND_ACCEL_2,GND_ACCUM,GND_AUX,GND_BRAKE,GND_BRAKE_1,GND_BRAKE_2,GND_BR_TS,GND_CHASSIS,GND_CURRENT,GND_DASH,GND_DCDC_1,GND_DCDC1,GND_DCDC2,GND_DCDC_2,GND_LEFT_PANEL,GND_MAIN_ECU,GND_MAINT,GND_MC,GND_POWER_SWITCHING,GND_RADIATOR,GND_TSAL_GREEN,GND_TSAL_RED,IMD_OK,INVERTER_24VIN,INVERTER_EN,ISOSPI_M,ISOSPI_P,LATCH_EXT_BTN,MC_MAINT_FAULT_INDIC,MC_MAINT_GND,MC_MAINT_PROG_ENA,MC_MAINT_RXD,MC_MAINT_TXD,MC_MAINT_XDCR_PWR,MOTOR_TEMP+,MOTOR_TEMP-,N$1,N$2,N$3,N$4,N$5,N$6,N$7,N$8,N$9,N$10,N$11,N$12,N$13,N$14,N$15,N$16,N$17,N$18,N$19,N$21,N$22,N$23,N$24,N$26,N$27,N$28,N$29,N$30,N$31,N$32,N$33,N$34,N$35,N$36,N$37,N$38,N$40,N$41,N$42,N$43,N$44,N$45,N$46,N$47,N$48,N$49,N$50,N$51,N$52,N$53,N$55,N$56,N$57,N$60,N$62,N$63,N$64,N$65,N$66,N$67,N$68,N$69,N$72,N$75,N$76,N$77,N$78,N$79,N$81,N$82,N$94,N$102,N$104,N$105,N$106,N$107,N$108,PACK+,PRECHARGE_OK,RET_FAN_1,SHDN_S,SHUTDOWN_G,SHUTDOWN_J,SHUTDOWN_K,SHUTDOWN_L,SHUTDOWN_M,SHUTDOWN_N,SHUTDOWN_S,SIGNAL_ACCEL_1,SIGNAL_ACCEL_2,SIGNAL_BRAKE,SIGNAL_BRAKE_1,SIGNAL_BRAKE_2,SIGNAL_CURRENT,START,TS+_METER,TS+_UNFUSED,USB_D+,USB_D-,USB_GND,USB_VCC,WHEEL_SPEED_2,WHEEL_SPEED_3,WHEEL_SPEED_4,WHEEL_SPEED_FRONT_LEFT,WHEEL_SPEED_FRONT_RIGHT,WHEEL_SPEED_REAR_LEFT,WHEEL_SPEED_REAR_RIGHT
5V_ACCEL_1,5V_ACCEL_2,5V_BRAKE,5V_BRAKE_1,5V_BRAKE_2,+5V_MOTOR,12V_ACCUM,12VSUPPLY_COOLING_PUMP_1,12VSUPPLY_COOLING_PUMP_2,12V_TSAL,24V_ACCULUMATOR_SUPPLY,24V_DASH,24VIN,24V_INVERTERS,24V_MAIN,24V_MAINT,24V_SUPPLY,AMS_OK,B$1,BAT+,BPSD+,BRAKE_LIGHT,BSPD-,CANH1,CANH2,CANH_ACCUM,CANH_DASH,CANH_MAINT,CANH_MC,CANL1,CANL2,CANL_ACCUM,CANL_DASH,CANL_MAINT,CANL_MC,CB2_ISO_SPI_N,CB2_ISO_SPI_P,CB3_ISO_SPI_N,CB3_ISO_SPI_P,CURRENT_SENSOR,CURRENT_SENSOR_REF,DASH_1,DASH_4,DASH_5,DASH_6,DASH_8,DASH_9,DASH_11,DASH_12,ENCODER_CLK+,ENCODER_CLK-,ENCODER_DATA+,ENCODER_DATA-,FL_MOTOR_ENCODER_CLK_+-,FL_MOTOR_ENCODER_DATA+-,FL_MOTOR_ENCODER_TEMP+-,FR_MOTOR_ENCODER_CLK_+-,FR_MOTOR_ENCODER_DATA+-,FR_MOTOR_ENCODER_TEMP+-,GND,GND_ACCEL_1,GND_ACCEL_2,GND_ACCUM,GND_AUX,GND_BRAKE,GND_BRAKE_1,GND_BRAKE_2,GND_CHASSIS,GND_DASH,GND_MAINT,GND_RADIATOR,GND_TSAL_GREEN,GND_TSAL_RED,IMD_OK,INVERTER_24V,INVERTER_24VIN,INVERTER_COOLING_24V,INVERTER_COOLING_GND,INVERTER_EN,ISOSPI_M,ISOSPI_P,LATCH_BTN,LATCH_EXT_BTN,MOTOR_3PHASE_INTERLOCK_X4,MOTOR_COOLING_24V,MOTOR_COOLING_GND,MOTOR_TEMP+,MOTOR_TEMP-,N$1,N$2,N$3,N$4,N$5,N$6,N$7,N$8,N$9,N$10,N$11,N$12,N$13,N$14,N$15,N$16,N$17,N$18,N$19,N$20,N$21,N$22,N$23,N$24,N$25,N$26,N$27,N$28,N$29,N$30,N$31,N$32,N$33,N$34,N$35,N$36,N$37,N$38,N$39,N$40,N$41,N$42,N$43,N$44,N$45,N$46,N$47,N$48,N$49,N$50,N$51,N$52,N$53,N$54,N$55,N$56,N$57,N$58,N$59,N$60,N$62,N$63,N$64,N$65,N$66,N$67,N$68,N$69,N$70,N$71,N$72,N$73,N$74,N$75,N$76,N$77,N$78,N$79,N$80,N$81,N$82,N$83,N$84,N$85,N$86,N$87,N$88,N$89,N$90,N$91,N$92,N$93,N$94,N$95,N$96,N$97,N$98,N$99,N$100,N$101,N$102,N$103,N$104,N$105,N$106,N$107,N$108,N$109,N$110,N$111,N$112,N$113,N$114,N$115,N$116,N$117,N$118,N$119,N$120,N$121,N$122,N$123,N$124,N$125,N$126,N$127,N$128,N$129,N$130,N$131,N$132,N$133,N$134,N$135,N$136,N$137,N$138,N$139,N$140,N$141,N$142,N$143,N$144,N$145,N$146,N$147,N$148,N$149,N$150,N$151,N$152,N$153,N$154,N$155,N$156,N$157,N$158,N$159,N$160,N$161,N$162,N$163,N$164,N$165,N$166,N$167,N$168,N$169,N$170,N$171,N$172,N$173,N$174,N$175,N$176,N$177,N$178,N$179,N$180,N$181,N$182,N$183,N$184,N$185,N$186,N$187,N$188,N$189,N$190,N$191,N$192,N$193,N$194,N$195,N$196,N$197,N$198,N$199,N$200,N$201,N$202,N$203,PACK+,PRECHARGE_OK,RET_FAN_1,RL_MOTOR_INTERLOCK,RR_MOTOR_INTERLOCK,SHDN_S,SHUTDOWN,SHUTDOWN_G,SHUTDOWN_J,SHUTDOWN_K,SHUTDOWN_L,SHUTDOWN_M,SHUTDOWN_N,SHUTDOWN_S,SIGNAL_ACCEL_1,SIGNAL_ACCEL_2,SIGNAL_BRAKE,SIGNAL_BRAKE_1,SIGNAL_BRAKE_2,SIGNAL_CURRENT,SIGNAL_CURRENT_REF,SIGNAL_REF,STEERING_ANALOG,STEERING_CS,STEERING_MOSI,STEERING_RX,STEERING_TX,SUS_POT_3,SUS_POT_4,TS+_METER,TS+_UNFUSED,USB_D+,USB_D-,USB_GND,USB_VCC,WHEEL_SPEED_2,WHEEL_SPEED_3,WHEEL_SPEED_4
5V_ACCEL_1,5V_ACCEL_2,5V_BRAKE_1,5V_BRAKE_2,+5V_MOTOR,12V_ACCUM,12VSUPPLY_COOLING_PUMP_1,12VSUPPLY_COOLING_PUMP_2,12V_TSAL,24V_ACCULUMATOR_SUPPLY,24V_DASH,24VIN,24V_INVERTERS,24V_MAIN,24V_MAINT,24V_SUPPLY,AMS_OK,B$1,BAT+,BPSD+,BRAKE_LIGHT,BSPD-,CANH1,CANH2,CANH_ACCUM,CANH_DASH,CANH_MAINT,CANL1,CANL2,CANL_ACCUM,CANL_DASH,CANL_MAINT,CB2_ISO_SPI_N,CB2_ISO_SPI_P,CB3_ISO_SPI_N,CB3_ISO_SPI_P,CURRENT_SENSOR,CURRENT_SENSOR_REF,ENCODER_CLK-,ENCODER_CLK+,ENCODER_DATA-,ENCODER_DATA+,FL_MOTOR_ENCODER_CLK_+-,FL_MOTOR_ENCODER_DATA+-,FL_MOTOR_ENCODER_TEMP+-,FR_MOTOR_ENCODER_CLK_+-,FR_MOTOR_ENCODER_DATA+-,FR_MOTOR_ENCODER_TEMP+-,GND,GND_ACCEL_1,GND_ACCUM,GND_BRAKE,GND_BRAKE_1,GND_BRAKE_2,GND_CHASSIS,GND_DASH,GND_MAINT,GND_RADIATOR,GND_TSAL_GREEN,GND_TSAL_RED,IMD_OK,INVERTER_24V,INVERTER_24VIN,INVERTER_COOLING_24V,INVERTER_COOLING_GND,INVERTER_EN,ISOSPI_M,ISOSPI_P,LATCH_BTN,LATCH_EXT_BTN,MOTOR_3PHASE_INTERLOCK_X4,MOTOR_COOLING_24V,MOTOR_COOLING_GND,MOTOR_TEMP-,MOTOR_TEMP+,N$1,N$2,N$3,N$4,N$5,N$6,N$7,N$8,N$9,N$10,N$11,N$12,N$13,N$14,N$15,N$16,N$17,N$18,N$19,N$20,N$21,N$22,N$23,N$24,N$25,N$26,N$27,N$28,N$29,N$30,N$31,N$32,N$33,N$34,N$35,N$36,N$37,N$38,N$39,N$40,N$41,N$42,N$43,N$44,N$45,N$46,N$47,N$48,N$49,N$50,N$51,N$52,N$53,N$54,N$55,N$56,N$57,N$58,N$59,N$60,N$62,N$63,N$64,N$65,N$66,N$67,N$68,N$69,N$70,N$71,N$72,N$73,N$74,N$75,N$76,N$77,N$78,N$79,N$80,N$81,N$82,N$83,N$84,N$85,N$86,N$87,N$88,N$89,N$90,N$91,N$92,N$93,N$94,N$95,N$96,N$97,N$98,N$99,N$100,N$101,N$102,N$103,N$104,N$105,N$106,N$107,N$108,N$109,N$110,N$111,N$112,N$113,N$114,N$115,N$116,N$117,N$118,N$119,N$120,N$121,N$122,N$123,N$124,N$125,N$126,N$127,N$128,N$129,N$130,N$131,N$132,N$133,N$134,N$135,N$136,N$137,N$138,N$139,N$140,N$141,N$142,N$143,N$144,N$145,N$146,N$147,N$148,N$149,N$150,N$151,N$152,N$153,N$154,N$155,N$156,N$157,N$158,N$159,N$160,N$161,N$162,N$163,N$164,N$165,N$166,N$167,N$168,N$169,N$170,N$171,N$172,N$173,N$174,N$175,N$176,N$177,N$178,N$179,N$180,N$181,N$182,N$183,N$184,N$185,N$186,N$187,N$188,N$189,N$190,N$191,N$192,N$193,N$194,N$195,N$196,N$197,N$198,N$199,N$200,N$201,N$202,N$203,PACK+,PRECHARGE_OK,RL_MOTOR_INTERLOCK,RR_MOTOR_INTERLOCK,SHDN_S,SHUTDOWN,SHUTDOWN_G,SHUTDOWN_J,SHUTDOWN_K,SHUTDOWN_L,SHUTDOWN_M,SHUTDOWN_N,SHUTDOWN_S,SIGNAL_ACCEL_1,SIGNAL_ACCEL_2,SIGNAL_BRAKE_1,SIGNAL_BRAKE_2,SIGNAL_CURRENT,SIGNAL_CURRENT_REF,SIGNAL_REF,STEERING_ANALOG,STEERING_CS,STEERING_MOSI,STEERING_RX,STEERING_TX,SUS_POT_3,SUS_POT_4,TS+_METER,TS+_UNFUSED,USB_D+,USB_D-,USB_GND,USB_VCC
B$1

## Notes on the sheet
- HyTech Racing 2024 FSAE Electrical Diagram
- Firewall | Dashboard
- HVD
- TO_COMPUTER
- Pedal Box
- 8STA60435SN | 8STA60435PN
- PEDAL_1 | PEDAL_1
- 8STA60435SA | 8STA60435PA
- Accumulator Container | PEDAL_2 | PEDAL_2
- 8STA60435SB | 8STA60435PB
- Inverter Enclosure
- 8STA60435SN | 8STA60435PN
- BRAKE_1 | BRAKE_1
- Main Electronic Control Unit
- 8STA60435SA | 8STA60435PA
- Right Rear Panel
- Left Rear Panel | BRAKE_2 | BRAKE_2
- USB
- LEFT_BRB
- TSAL
- Maintenance
- CHASSIS
- Wire Key
  Thin Green: GLV
  Blue: GLV Buses
  Thick Green: HV
  Orange: HV High Current Path

## Library data of the parts
ACCUMULATOR_INDICATOR_LIGHT = HyTechDevices:LED_?_*: LED Blue <https://www.mouser.com/datasheet/2/216/APT1608VBC_D-246010.pdf> Green <https://www.mouser.com/datasheet/2/216/APT1608ZGCK-1173388.pdf> Orange <https://www.mouser.com/datasheet/2/216/APT1608SECK-6197.pdf> Red <https://www.mouser.com/datasheet/2/216/APT1608SECK-J3-PRV-1173336.pdf> White <https://www.mouser.com/datasheet/2/50/SM0603UWC-880813.pdf> Yellow <https://www.mouser.com/datasheet/2/216/APT1608SYCK-J3-PRV-1173311.pdf>; COLOR: Red; DKPN: 754-1786-1-ND; MANUFACTURER: Kingbright; MOPN: 604-APT1608SECKJ3PRV; MPN: APT1608SECK/J3-PRV
AIR1 AIR2 = HyTechSymbols:RELAY_SPST_NO_?*: Single pole single throw normally open relay 3350-1275-126 <https://drive.google.com/file/d/1L0NeZqCX2TFaVQbwFxpbbu9uMJSPuulv/view> GX23BA <https://drive.google.com/file/d/1Ccq0vir690jgHxUhztItQKfgtS51YNj_/view>; MANUFACTURER: Gigavac; MPN: GX23CA
BOTS COCKPIT_BRB GLVMS HVD_INTERLOCK INERTIA_SWITCH TSMS = HyTechSymbols:SWITCH_SPST: Single Pull Single Throw Switch
BPSD- BSPD+ MEASURE_24V MEASURE_GND TSMP+1 TSMP-1 = HyTechSymbols:BANANA_JACK: Banana Jack Purchasing: Mouser - Red <http://www.mouser.com/ProductDetail/Pomona-Electronics/72930-2/?qs=2nDnb8a6ouM2t6dPw1JBow%3D%3D> Mouser - Black <http://www.mouser.com/ProductDetail/Pomona-Electronics/72930-0/?qs=2nDnb8a6ouNpA2wl9kKnzA%3D%3D>
BRAKE_LIGHT = HyTechSymbols:LED: Generic LED
BUTTON_DIMMER BUTTON_MARK BUTTON_MC_CYCLE BUTTON_MODE BUTTON_START LATCH_BTN = HyTechSymbols:SWITCH_SPST_MOM: Single Pull Single Throw Switch Momentary
DASH_IN_3 DASH_IN_4 = HyTechSymbols:M08: Generic 8-pin connector
FUSE1 FUSE2 MAIN_FUSE = HyTechSymbols:FUSE: Generic Fuse
GLV_BATT SEGMENT1-SEGMENT6 = HyTechSymbols:BATTERY_1_CELL: Generic 1-cell battery Source: Sonnenschein
J1 = HyTechDevicesTemp:CONNECTOR-22_?_*: 22 pin connector; MANUFACTURER: SOURIAU
J2 = HyTechSymbolsTemp:CONNECTOR-4_*: Four pin connector Micro-Fit 3.0 <https://drive.google.com/file/d/1Be8WGxzm3IeOWSN4qfSP8J4bwHUWCwaO/view>
J3 J15 J16 = HyTechDevices:CONNECTOR-6_?_*: 6 Pin Connector; DKPN: WM15062-ND; MANUFACTURER: Molex; MOPN: 538-105310-1306; MPN: 105310-1306
J4 J18 J20 J31 J33 = HyTechSymbols:CONNECTOR-4_*: Four pin connector Micro-Fit 3.0 <https://drive.google.com/file/d/1Be8WGxzm3IeOWSN4qfSP8J4bwHUWCwaO/view>
J5-J14 = HyTechSymbolsTemp:CONNECTOR-3_*: Three pin connector HV02-M3S(40A)-M00A-1 <https://drive.google.com/file/d/14-0BdluqhzWVuxobIuHQclYd8S9S8AFy/view> NEMA-5-20 <https://drive.google.com/file/d/1QyRJhkZq4Jge6F64jD-5aG-LjfEdAoZD/view>
J17 J19 J32 J34 = HyTechSymbols:CONNECTOR-2_*: Two pin connector EVH2-N2TK-TDA <https://drive.google.com/file/d/1gQfuywpa-Tm7bohh-tcSjjxbyqcnD_h9/view> HPK <https://drive.google.com/file/d/1jTQMZ26zoHotHQHZYMoMT2jUzRt664sO/view> HVP800 <https://drive.google.com/file/d/1j-HswfqYHj8usJ9E3bf8NWBzB-X0BKJ4/view>; MANUFACTURER: Molex; MPN: 0436500214
J21-J23 J30 = HyTechDevices:CONNECTOR-37_?_*: 37 pin connector Datasheet <https://www.mouser.com/datasheet/2/379/P088_P096-179693.pdf>; MANUFACTURER: Souriau; MOPN: 649-8STA21435PN; MPN: 8STA21435PN
J24 = HyTechSymbols:CONNECTOR-8_*: Eight pin connector Micro-Fit 3.0 <https://drive.google.com/file/d/1Be8WGxzm3IeOWSN4qfSP8J4bwHUWCwaO/view>
J25 = HyTechSymbols:CONNECTOR-8_*: Eight pin connector Micro-Fit 3.0 <https://drive.google.com/file/d/1Be8WGxzm3IeOWSN4qfSP8J4bwHUWCwaO/view>; MANUFACTURER: AMPHENOL; MPN: M12A-08PMMS
J28 J29 = HyTechSymbols:CONNECTOR-2_*: Two pin connector EVH2-N2TK-TDA <https://drive.google.com/file/d/1gQfuywpa-Tm7bohh-tcSjjxbyqcnD_h9/view> HPK <https://drive.google.com/file/d/1jTQMZ26zoHotHQHZYMoMT2jUzRt664sO/view> HVP800 <https://drive.google.com/file/d/1j-HswfqYHj8usJ9E3bf8NWBzB-X0BKJ4/view>; MANUFACTURER: Hirose Electric; MPN: EM30MSD
J35 = HyTechSymbols:CONNECTOR-3_*: Three pin connector XXC106-EV-P3Z <https://drive.google.com/file/d/1qR1Rhcju7C1tSf9gvk0xHmD0lfie2p2O/view?usp=sharing> HV02-M3S(40A)-M00A-1 <https://drive.google.com/file/d/14-0BdluqhzWVuxobIuHQclYd8S9S8AFy/view> NEMA-5-20 <https://drive.google.com/file/d/1QyRJhkZq4Jge6F64jD-5aG-LjfEdAoZD/view>; MANUFACTURER: TE; MPN: 2371035-2
J36 = HyTechSymbols:CONNECTOR-3_*: Three pin connector XXC106-EV-P3Z <https://drive.google.com/file/d/1qR1Rhcju7C1tSf9gvk0xHmD0lfie2p2O/view?usp=sharing> HV02-M3S(40A)-M00A-1 <https://drive.google.com/file/d/14-0BdluqhzWVuxobIuHQclYd8S9S8AFy/view> NEMA-5-20 <https://drive.google.com/file/d/1QyRJhkZq4Jge6F64jD-5aG-LjfEdAoZD/view>; MANUFACTURER: TE; MPN: 1-2371113-2
PUMP_1-PUMP_4 = HyTechSymbols:M02: Generic 2-pin connector
S2 = HyTechSymbols:SWITCH_SPST_*: Single Pull Single Throw Switch EAO Series 61 27mm Illuminated Emergency Stop Swtich <https://eao.com/fileadmin/documents/PDFs/en/03_brochures/EAO_PB_61_E-Stop_Compact_EN.pdf> EAO Series 45 40mm Illuminated Emergency Stop Swtich <https://hmi.eao.com/p/965f6719> EAO Series 45 34mm Illuminated Emergency Stop Switch <https://hmi.eao.com/p/5909b34f> TE Battery Disconnector Switch <https://www.mouser.com/datasheet/2/418/8/ENG_CD_35_210_100_R_900_5-2533843.pdf>; MANUFACTURER: EAO; MPN: Series 45 E-Stop
S3 = HyTechSymbols:SWITCH_SPST_*: Single Pull Single Throw Switch EAO Series 61 27mm Illuminated Emergency Stop Swtich <https://eao.com/fileadmin/documents/PDFs/en/03_brochures/EAO_PB_61_E-Stop_Compact_EN.pdf> EAO Series 45 40mm Illuminated Emergency Stop Swtich <https://hmi.eao.com/p/965f6719> EAO Series 45 34mm Illuminated Emergency Stop Switch <https://hmi.eao.com/p/5909b34f> TE Battery Disconnector Switch <https://www.mouser.com/datasheet/2/418/8/ENG_CD_35_210_100_R_900_5-2533843.pdf>; MANUFACTURER: EAO; MPN: REAR_RIGHT_BRB
TSAL_1 TSAL_2 = HyTechSymbols:M04: Generic 4-pin connector
U$1 U$3-U$11 U$15 U$18-U$20 = HyTechSymbolsTemp:MAINTENANCE_PLUG_*; MANUFACTURER: TE; MPN: 104742-2
U$2 = HyTechSymbols:BENDER_IR155-3204: Bender IR155-3204 Insulation Monitoring Device Datasheet <http://www.bender-es.com/fileadmin/products/doc/IR155-32xx-V004_D00115_D_XXEN.pdf>
U$12 = HyTechSymbols:AMKBIG
U$13 U$14 U$16 U$17 = HyTechSymbols:MOTOR_AC_SMALL_*: Generic three-phase AC electric motor; MANUFACTURER: AMK; MPN: DD5-14-10-POW-18600-B5
U$21 U$22 = HyTechSymbols:CONNECTOR-2_*: Two pin connector EVH2-N2TK-TDA <https://drive.google.com/file/d/1gQfuywpa-Tm7bohh-tcSjjxbyqcnD_h9/view> HPK <https://drive.google.com/file/d/1jTQMZ26zoHotHQHZYMoMT2jUzRt664sO/view> HVP800 <https://drive.google.com/file/d/1j-HswfqYHj8usJ9E3bf8NWBzB-X0BKJ4/view>; MANUFACTURER: TE; MPN: HVP800

## Module HV_BOARD
Ports: 60V_THRESHOLD(out) IMD_SUPPLY(pwr) IMD_GND(pwr) IMD_HV+(nc) IMD_HV-(nc) HV+UNFUSED(pwr) HV-UNFUSED(pwr) 12VSUPPLY(pwr) BMS_OK_OUT(out) HV+FUSED(pwr) HV-FUSED(pwr) SHUTDOWN_K_OUT(out) SHUTDOWN_K_IN(in) SHUTDOWN_I_OUT(out) IMD_OK(in) IMD_OK_OUT(out) CHARGE_ENABLE(out) DISCHARGE+(out) DISCHARGE-(in) ISOSPI_P(io) ISOSPI_M(io) CUR_5V_1(pwr) CUR_SENSE_RAW_1(in) TEMP_SENSE_RAW_1(in) CUR_GND_1(pwr) GND(pwr) SIGNAL_CURRENT(out) SHUTDOWN_I_IN(in) CANH(io) CANL(io) INDICATOR+(out) INDICATOR-(in) USB_D+(io) USB_D-(io) CANL_EM(io) CANH_EM(io)

### Library data of the parts

## Module BMS_SEGMENT
Ports: ISOSPI_1M(io) ISOSPI_1P(io) ISOSPI_2P(io) ISOSPI_2M(io)

### Library data of the parts

## Module ENERGY_METER
Ports: HV+IN(in) HV-OUT(in) HV-IN(out) VCC(pwr) GND(pwr) CANH(io) CANL(io)

### Library data of the parts

## Module COOLING_MODULE
Ports: +24V(in) GND(out)

### Library data of the parts

## Module BMS_SEGMENT_TEST
Ports: BMS_CELL_TEST_1(out) BMS_CELL_TEST_2(in) ISOSPI_1M(io) ISOSPI_1P(io) ISOSPI_2P(io) ISOSPI_2M(io) BMS_THERM_TEST_1(io) BMS_THERM_TEST_2(io)

### Library data of the parts

## Module MAIN_ECU
Ports: SIGNAL_CURRENT(in) SIGNAL_ACCEL_2(in) AMS_OK(in) IMD_OK(in) SIGNAL_BRAKE_1(in) SIGNAL_BRAKE_2(in) BRAKE_LIGHT(out) LATCH_EXT_BTN(in) SIGNAL_ACCEL_1(in) 24VIN(io) GND(io) INVERTER_24V(io) INVERTER_EN(io) SIGNAL_REF(io) ANALOG_IN(io) TX(io) RX(io) CB3_ISO_SPI_P(io) CB3_ISO_SPI_N(io) CB4_ISO_SPI_P(io) CB4_ISO_SPI_N(io) CANH1(io) CANL1(io) CANH2(io) CANL2(io)

### Library data of the parts

## Module BEI_9360
Ports: GND_SENSOR_1(pwr) GND_SENSOR_2(pwr) SIGNAL_SENSOR_1(out) SIGNAL_SENSOR_2(out) 5V_SENSOR_1(pwr) 5V_SENSOR_2(pwr)

### Library data of the parts

## Module TE_M3031
Ports: 5V(pwr) GND(pwr) SIGNAL(out)

### Library data of the parts

## Module POWER_SWITCHING
Ports: OUT_1(out) OUT_2(out) GLV_BATTERY(in) GLV_BATTERY_2(in) DCDC(in) DCDC_2(in) START(in) AFTER_BRB(in) GND(pwr)

### Library data of the parts

## Module ACU
Ports: IM(io) IP(io) USB_GND(io) USB_D-(io) USB_D+(io) USB_VCC(io) CHASSIS_GND(io) TSAL_GREEN(io) TSAL_RED(io) SHDN_IN(io) BSPD_CURRENT(io) AMS_OK(io) IMD_OK(io) GND(io) CANL2(io) CANH2(io) 24V(io) CUR_GND(io) CUR_REF(io) CUR_SENSE(io) CUR_5V(io) OKHS(io) MHS(io) ACCUMULATOR_GND(io) CHASSIS_GND_IMD(io) 24V_IMD(io) GND_IMD(io) CANL_EM(io) CANH_EM(io) GND_EM(io) 24V_EM(io) PRECHARGE_OK(io) SHUTDOWN(io) 24V_TSB(io) SHDN_TSB(io) PRECHARGE_OK_TSB(io) IP+(io) IP-(io) IM+(io) IM-(io)

### Library data of the parts

## Module DASHBOARD
Ports: 24V(io) CANL(io) CANH(io) SHUTDOWN_H(io) SHUTDOWN_G(io) SHUTDOWN_F(io) GND(io) BTN_GND(io) BTN_MARK(io) BTN_MC_CYCLE(io) BTN_MODE(io) BTN_START(io) BTN_DIMMER(io) DIAL_SAFE_MODE(io) DIAL_MODE_1(io) DIAL_MODE_2(io) DIAL_MODE_3(io) DIAL_MODE4(io) DIAL_MODE_5(io)

### Library data of the parts

## Module TSB
Ports: 24V_ACU(io) SHDN_ACU(io) PRECHARGE_OK_ACU(io) IP+(io) IP-(io) IM+(io) IM-(io) TS+_FUSED(io) TS-_FUSED(io) TS+_IMD(io) TS-_IMD(io) TS+_UNFUSED(io) LED+(io) TS-_FUSED_LED(io) PACK+(io)

### Library data of the parts

## Module TSAL
Ports: 12V(io) GND_RED(io) GND_GREEN(io)

### Library data of the parts

## Module CUR_SENSE
Ports: GND(io) REF(io) SENSE(io) 5V(io) BSPD-(io) BSPD+(io)

### Library data of the parts

## Module DISCHARGE
Ports: SHDN_S(io) GND(io) TS+(io) TS-(io) TSMP+(io) TSMP-(io)

### Library data of the parts

## Module TOP_STEERING_SENSOR
Ports: 5VIN(io) GND(io) TX(io) RX(io)

### Library data of the parts

## Module BOTTOM_STEERING_SENSOR
Ports: 5VIN(io) GND(io) ANALOG_OUT(io)

### Library data of the parts

## Module CORNER_BOARD
Ports: 24VIN(io) GND(io) MOTOR_INTERLOCK_IN(io) MOTOR_INTERLOCK_OUT(io) LOAD_CELL_IN+(io) LOAD_CELL_10V(io) LOAD_CELL_GND(io) LOAD_CELL_IN-(io) SUS_POT_1_IN(io) SUS_POT_2_IN(io) ISO_SPI_P(io) ISO_SPI_N(io)

### Library data of the parts

## Module SAB
Ports: 24VIN(pas) GND(pas) MOTOR_INTERLOCK_IN(pas) MOTOR_INTERLOCK_OUT(pas) CB1_ISO_SPI_P(pas) CB1_ISO_SPI_N(pas) CB2_ISO_SPI_P(pas) CB2_ISO_SPI_N(pas) MOTOR2_INTERLOCK_IN(pas) MOTOR2_INTERLOCK_OUT(pas) INS_TX(pas) INS_RX(pas) GPS_PPS(pas) CAN2H(pas) CAN2L(pas) 12V_OUT(pas)

### Library data of the parts

## Module TCU
Ports: ETHERNET(io) CAN2H(io) CAN2L(io) 24VIN(io) GND(io)

### Library data of the parts

## Module DUAL_GNSS/INS
Ports: GPS1(io) GPS2(io) 12VIN(io) GND(io) SAB_TX(io) SAB_RX(io)

### Library data of the parts

## Module GPS
Ports: COAX(io)

### Library data of the parts